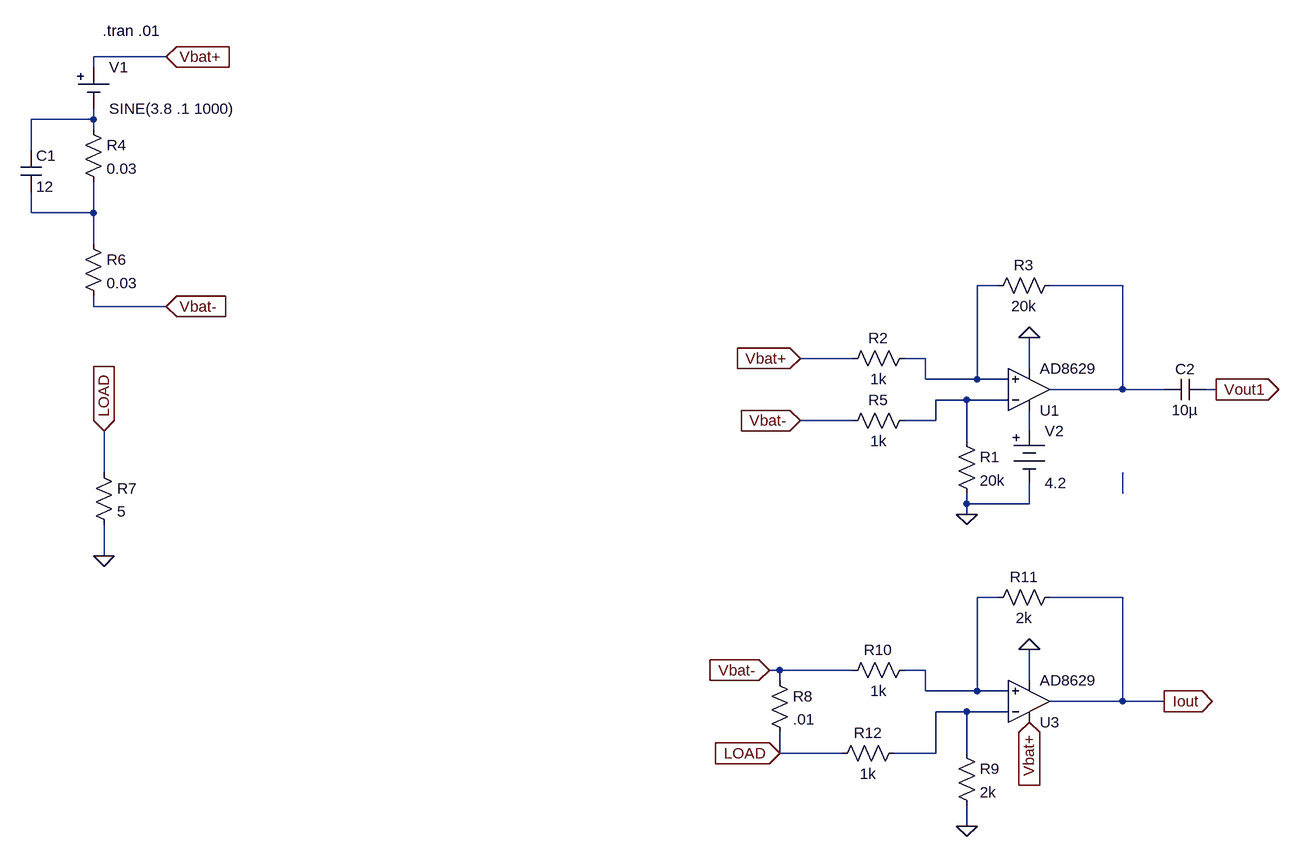
[diagram p0: schematic Draft1.asc]
Draft1.asc, the LTspice schematic file:
Version 4
SHEET 1 880 788
WIRE -1104 -416 -1216 -416
WIRE -1216 -400 -1216 -416
WIRE -1216 -320 -1216 -336
WIRE -1216 -320 -1312 -320
WIRE -1216 -304 -1216 -320
WIRE -1312 -272 -1312 -320
WIRE -1312 -176 -1312 -208
WIRE -1216 -176 -1216 -224
WIRE -1216 -176 -1312 -176
WIRE -1216 -128 -1216 -176
WIRE 176 -64 144 -64
WIRE 368 -64 256 -64
WIRE -1216 -32 -1216 -48
WIRE -1104 -32 -1216 -32
WIRE -48 48 -128 48
WIRE 64 48 32 48
WIRE 224 64 224 16
WIRE 64 80 64 48
WIRE 144 80 144 -64
WIRE 144 80 64 80
WIRE 192 80 144 80
WIRE 368 96 368 -64
WIRE 368 96 256 96
WIRE 432 96 368 96
WIRE 512 96 496 96
WIRE 128 112 80 112
WIRE 192 112 128 112
WIRE -48 144 -128 144
WIRE 80 144 80 112
WIRE 80 144 32 144
WIRE 224 160 224 128
WIRE 128 176 128 112
WIRE -1200 224 -1200 160
WIRE 368 256 368 224
WIRE 128 272 128 256
WIRE 224 272 224 240
WIRE 224 272 128 272
WIRE 128 288 128 272
WIRE -1200 352 -1200 304
WIRE 176 416 144 416
WIRE 368 416 256 416
WIRE -160 528 -176 528
WIRE -48 528 -160 528
WIRE 64 528 32 528
WIRE -160 544 -160 528
WIRE 224 544 224 496
WIRE 64 560 64 528
WIRE 144 560 144 416
WIRE 144 560 64 560
WIRE 192 560 144 560
WIRE 368 576 368 416
WIRE 368 576 256 576
WIRE 432 576 368 576
WIRE 128 592 80 592
WIRE 192 592 128 592
WIRE -160 656 -160 624
WIRE -64 656 -160 656
WIRE 80 656 80 592
WIRE 80 656 16 656
WIRE 128 656 128 592
WIRE 128 768 128 736
FLAG -128 48 Vbat+
IOPIN -128 48 In
FLAG 224 16 0
FLAG 512 96 Vout1
IOPIN 512 96 Out
FLAG 128 288 0
FLAG -1104 -416 Vbat+
IOPIN -1104 -416 In
FLAG -128 144 Vbat-
IOPIN -128 144 In
FLAG -1104 -32 Vbat-
IOPIN -1104 -32 In
FLAG -1200 352 0
FLAG -1200 160 LOAD
IOPIN -1200 160 In
FLAG 224 496 0
FLAG 432 576 Iout
IOPIN 432 576 Out
FLAG 128 768 0
FLAG 224 608 Vbat+
IOPIN 224 608 In
FLAG -160 656 LOAD
IOPIN -160 656 In
FLAG -176 528 Vbat-
IOPIN -176 528 In
SYMBOL OpAmps\\AD8629 224 160 M180
SYMATTR InstName U1
SYMBOL res 112 160 R0
SYMATTR InstName R1
SYMATTR Value 20k
SYMBOL res 48 32 R90
WINDOW 0 0 56 VBottom 2
WINDOW 3 32 56 VTop 2
SYMATTR InstName R2
SYMATTR Value 1k
SYMBOL res 272 -80 R90
WINDOW 0 0 56 VBottom 2
WINDOW 3 32 56 VTop 2
SYMATTR InstName R3
SYMATTR Value 20k
SYMBOL res 48 128 R90
WINDOW 0 0 56 VBottom 2
WINDOW 3 32 56 VTop 2
SYMATTR InstName R5
SYMATTR Value 1k
SYMBOL res -1232 -320 R0
SYMATTR InstName R4
SYMATTR Value 0.03
SYMBOL cap -1328 -272 R0
SYMATTR InstName C1
SYMATTR Value 12
SYMBOL res -1232 -144 R0
SYMATTR InstName R6
SYMATTR Value 0.03
SYMBOL res -1216 208 R0
SYMATTR InstName R7
SYMATTR Value 5
SYMBOL OpAmps\\AD8629 224 640 M180
SYMATTR InstName U3
SYMBOL res 112 640 R0
SYMATTR InstName R9
SYMATTR Value 2k
SYMBOL res 48 512 R90
WINDOW 0 0 56 VBottom 2
WINDOW 3 32 56 VTop 2
SYMATTR InstName R10
SYMATTR Value 1k
SYMBOL res 272 400 R90
WINDOW 0 0 56 VBottom 2
WINDOW 3 32 56 VTop 2
SYMATTR InstName R11
SYMATTR Value 2k
SYMBOL res 32 640 R90
WINDOW 0 0 56 VBottom 2
WINDOW 3 32 56 VTop 2
SYMATTR InstName R12
SYMATTR Value 1k
SYMBOL res -176 528 R0
SYMATTR InstName R8
SYMATTR Value .01
SYMBOL Misc\\cell -1216 -400 R0
WINDOW 123 0 0 Left 0
WINDOW 39 0 0 Left 0
SYMATTR InstName V1
SYMATTR Value SINE(3.8 .1 1000)
SYMBOL cap 496 80 R90
WINDOW 0 0 32 VBottom 2
WINDOW 3 32 32 VTop 2
SYMATTR InstName C2
SYMATTR Value 10µ
SYMBOL Misc\\battery 224 144 R0
WINDOW 123 0 0 Left 0
WINDOW 39 0 0 Left 0
SYMATTR InstName V2
SYMATTR Value 4.2
TEXT -1202 -456 Left 2 !.tran .01

The netlist it stands for:
* Draft1.asc
XU1 N003 N005 N006 0 N004 AD8629  ; pins In+ In- V+ V- OUT
R1 N005 0 20k
R2 N003 Vbat+ 1k
R3 N004 N003 20k
R5 N005 Vbat- 1k
R4 N001 N002 0.03
C1 N001 N002 12
R6 N002 Vbat- 0.03
R7 LOAD 0 5
XU3 N008 N009 Vbat+ 0 Iout AD8629  ; pins In+ In- V+ V- OUT
R9 N009 0 2k
R10 N008 Vbat- 1k
R11 Iout N008 2k
R12 N009 LOAD 1k
R8 Vbat- LOAD .01
V1 Vbat+ N001 SINE(3.8 .1 1000)
C2 Vout1 N004 10µ
V2 N006 0 4.2
.tran .01
.backanno
.end